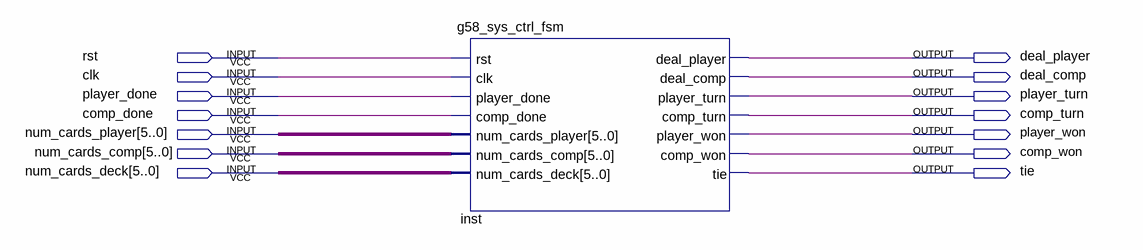
[diagram p0: schematic sheet]
// Quartus schematic g58_sys_ctrl_fsm_test.bdf as structural Verilog: 1 symbols, 14 pins
module g58_sys_ctrl_fsm_test (
  input  rst,
  input  clk,
  input  player_done,
  input  comp_done,
  input  [5:0] num_cards_player,
  input  [5:0] num_cards_comp,
  input  [5:0] num_cards_deck,
  output deal_player,
  output deal_comp,
  output player_turn,
  output comp_turn,
  output player_won,
  output comp_won,
  output tie
);

  g58_sys_ctrl_fsm inst (
    .rst(rst), .clk(clk), .player_done(player_done), .comp_done(comp_done),
    .num_cards_player(num_cards_player), .num_cards_comp(num_cards_comp), .num_cards_deck(num_cards_deck),
    .deal_player(deal_player), .deal_comp(deal_comp), .player_turn(player_turn), .comp_turn(comp_turn),
    .player_won(player_won), .comp_won(comp_won), .tie(tie));
endmodule
